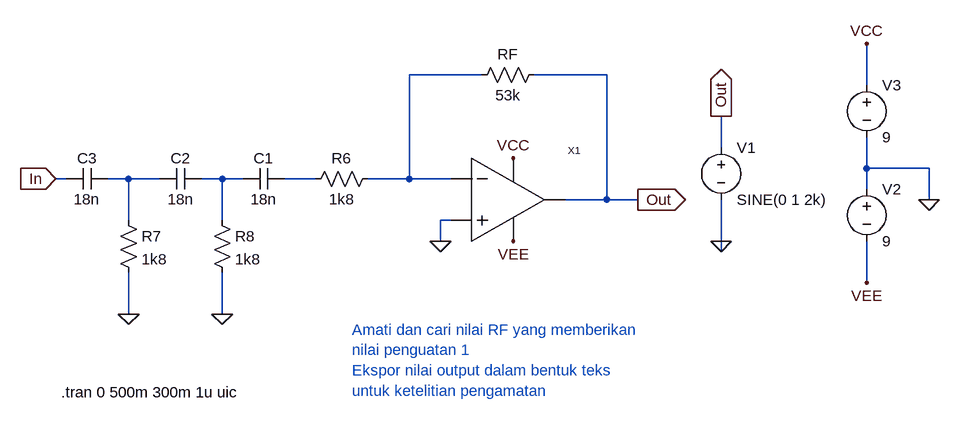
[diagram p0: schematic Perc-4-2-PhaseShifterOpenLoop.asc]
Perc-4-2-PhaseShifterOpenLoop.asc, the LTspice schematic file:
Version 4
SHEET 1 1076 708
WIRE 32 112 -80 112
WIRE 224 112 112 112
WIRE 624 128 624 64
WIRE 400 224 400 176
WIRE 624 256 624 208
WIRE 720 256 624 256
WIRE -608 272 -624 272
WIRE -512 272 -544 272
WIRE -464 272 -512 272
WIRE -368 272 -400 272
WIRE -336 272 -368 272
WIRE -224 272 -272 272
WIRE -80 272 -80 112
WIRE -80 272 -144 272
WIRE -16 272 -80 272
WIRE 624 288 624 256
WIRE 224 304 224 112
WIRE 224 304 160 304
WIRE 272 304 224 304
WIRE 720 304 720 256
WIRE -512 336 -512 272
WIRE -368 336 -368 272
WIRE -16 336 -32 336
WIRE -32 368 -32 336
WIRE 400 368 400 304
WIRE 400 384 400 368
WIRE 624 432 624 368
WIRE -512 480 -512 416
WIRE -368 480 -368 416
FLAG -32 368 0
FLAG 624 432 VEE
FLAG 80 368 VEE
FLAG 624 64 VCC
FLAG 720 304 0
FLAG 80 240 VCC
FLAG -512 480 0
FLAG -368 480 0
FLAG 272 304 Out
IOPIN 272 304 Out
FLAG -624 272 In
IOPIN -624 272 In
FLAG 400 176 Out
IOPIN 400 176 Out
FLAG 400 368 0
SYMBOL res 128 96 R90
WINDOW 0 0 56 VBottom 2
WINDOW 3 32 56 VTop 2
SYMATTR InstName RF
SYMATTR Value 53k
SYMBOL res -128 256 R90
WINDOW 0 0 56 VBottom 2
WINDOW 3 32 56 VTop 2
SYMATTR InstName R6
SYMATTR Value 1k8
SYMBOL voltage 624 272 R0
WINDOW 123 0 0 Left 0
WINDOW 39 0 0 Left 0
SYMATTR InstName V2
SYMATTR Value 9
SYMBOL voltage 624 112 R0
WINDOW 123 0 0 Left 0
WINDOW 39 0 0 Left 0
SYMATTR InstName V3
SYMATTR Value 9
SYMBOL cap -272 256 R90
WINDOW 0 0 32 VBottom 2
WINDOW 3 32 32 VTop 2
SYMATTR InstName C1
SYMATTR Value 18n
SYMBOL cap -400 256 R90
WINDOW 0 0 32 VBottom 2
WINDOW 3 32 32 VTop 2
SYMATTR InstName C2
SYMATTR Value 18n
SYMBOL cap -544 256 R90
WINDOW 0 0 32 VBottom 2
WINDOW 3 32 32 VTop 2
SYMATTR InstName C3
SYMATTR Value 18n
SYMBOL res -528 320 R0
SYMATTR InstName R7
SYMATTR Value 1k8
SYMBOL res -384 320 R0
SYMATTR InstName R8
SYMATTR Value 1k8
SYMBOL voltage 400 208 R0
WINDOW 123 0 0 Left 0
WINDOW 39 0 0 Left 0
SYMATTR InstName V1
SYMATTR Value SINE(0 1 2k)
SYMBOL Opampku 64 304 R0
SYMATTR InstName X1
TEXT -616 600 Left 2 !.tran 0 500m 300m 1u uic
TEXT -168 504 Left 2 ;Amati dan cari nilai RF yang memberikan \nnilai penguatan 1\nEkspor nilai output dalam bentuk teks \nuntuk ketelitian pengamatan

The netlist it stands for:
* Perc-4-2-PhaseShifterOpenLoop.asc
RF Out N001 53k
R6 N001 N004 1k8
V2 0 VEE 9
V3 VCC 0 9
C1 N004 N003 18n
C2 N003 N002 18n
C3 N002 In 18n
R7 N002 0 1k8
R8 N003 0 1k8
V1 Out 0 SINE(0 1 2k)
XX1 N001 0 VCC VEE Out Opampku  ; pins inn inp vp vn out
.tran 0 500m 300m 1u uic
* Amati dan cari nilai RF yang memberikan
* nilai penguatan 1
* Ekspor nilai output dalam bentuk teks
* untuk ketelitian pengamatan
.backanno
.end